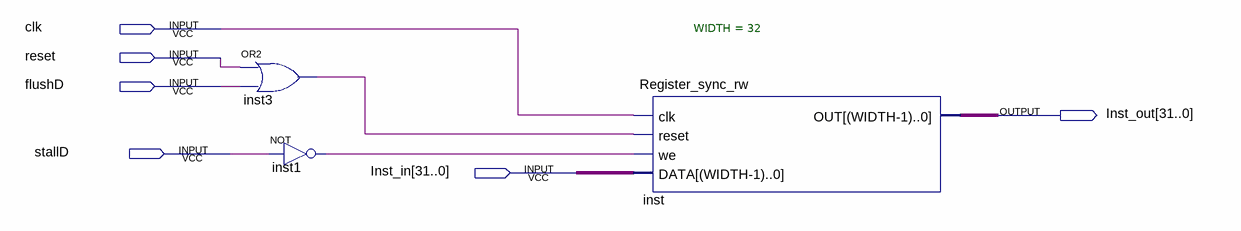
[diagram p0: schematic sheet]
// Quartus schematic decode_register.bdf as structural Verilog: 3 symbols, 6 pins
module decode_register (
  input  clk,
  input  reset,
  input  flushD,
  input  stallD,
  input  [31:0] Inst_in,
  output [31:0] Inst_out
);

  wire inst1_out, inst3_out;

  or inst3 (inst3_out, reset, flushD);
  not inst1 (inst1_out, stallD);
  Register_sync_rw #(.WIDTH(32)) inst (.clk(clk), .reset(inst3_out), .we(inst1_out), .DATA(Inst_in), .OUT(Inst_out));
endmodule
